# Altium project rasp_infrad.PrjPCB
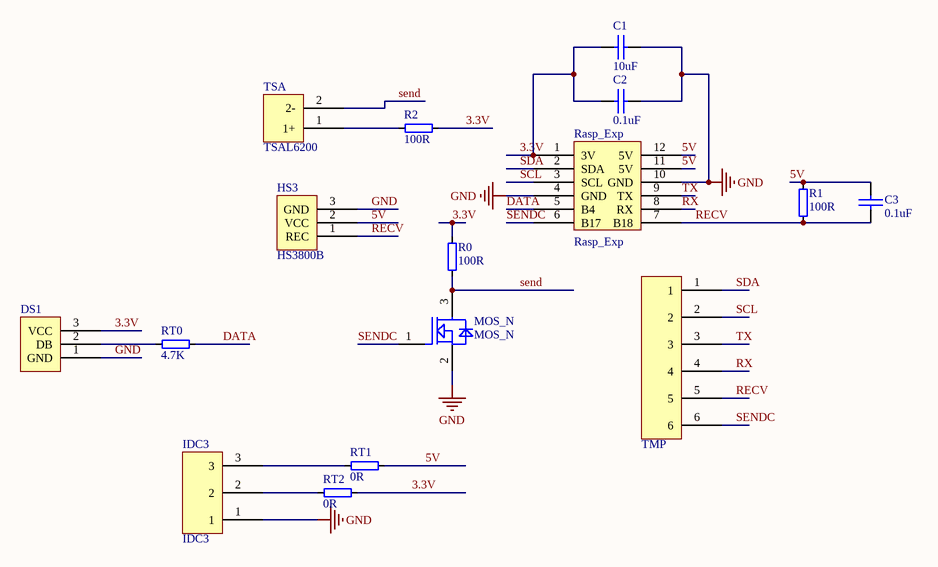
[diagram p0: rasp_infrad.SchDoc]
1 sheet, 16 parts. Net scope: global (net labels, ports and power ports of the same name join across sheets).
Board file: rasp_infrad.PcbDoc

## Sheet rasp_infrad.SchDoc
size A4

### Parts
C1  10uF  [0805]
C2  0.1uF  [0805]
C3  0.1uF  [0805]
DS1  DS1  [DS18B20]  (value not drawn)
HS3  HS3800B  [HS0038B]
IDC3  IDC3  [IDC3]
MOS_N  MOS_N  [MOSN]
R0  100R  [0805]
R1  100R  [0805]
R2  100R  [0805]
Rasp_Exp  Rasp_Exp  [Rasp_Exp]
RT0  4.7K  [0805]
RT1  0R  [0805]
RT2  0R  [0805]
TMP  IDC6  [IDC6]  (value not drawn)
TSA  TSAL6200  [TSAL6200]

### Nets
GND: C1.2 C2.2 DS1.1(GND) HS3.3(GND) IDC3.1 MOS_N.2 Rasp_Exp.4(GND) Rasp_Exp.10(GND)
3.3V: C1.1 C2.1 DS1.3(VCC) R0.2 R2.1 Rasp_Exp.1(3V) RT2.1
5V: C3.2 HS3.2(VCC) R1.2 Rasp_Exp.11(5V) Rasp_Exp.12(5V) RT1.1
DATA: Rasp_Exp.5(B4) RT0.1
RECV: C3.1 HS3.1(REC) R1.1 Rasp_Exp.7(B18) TMP.5
RX: Rasp_Exp.8(RX) TMP.4
SCL: Rasp_Exp.3(SCL) TMP.2
SDA: Rasp_Exp.2(SDA) TMP.1
send: MOS_N.3 R0.1 TSA.2(2-)
SENDC: MOS_N.1 Rasp_Exp.6(B17) TMP.6
TX: Rasp_Exp.9(TX) TMP.3
NetDS1_2: DS1.2(DB) RT0.2
NetIDC3_2: IDC3.2 RT2.2
NetIDC3_3: IDC3.3 RT1.2
NetR2_2: R2.2 TSA.1(1+)

### Library data of the parts
C1-C3 = 普通电容: Capacitor
DS1 = DS18B20: 数字温度传感器
HS3 = HS3800B: 红外接收管
IDC3 = 三脚引线孔
R0-R2 RT0-RT2 = RES
TMP = 六脚引线孔